# EAGLE schematic Table (EAGLE 6.5.0)
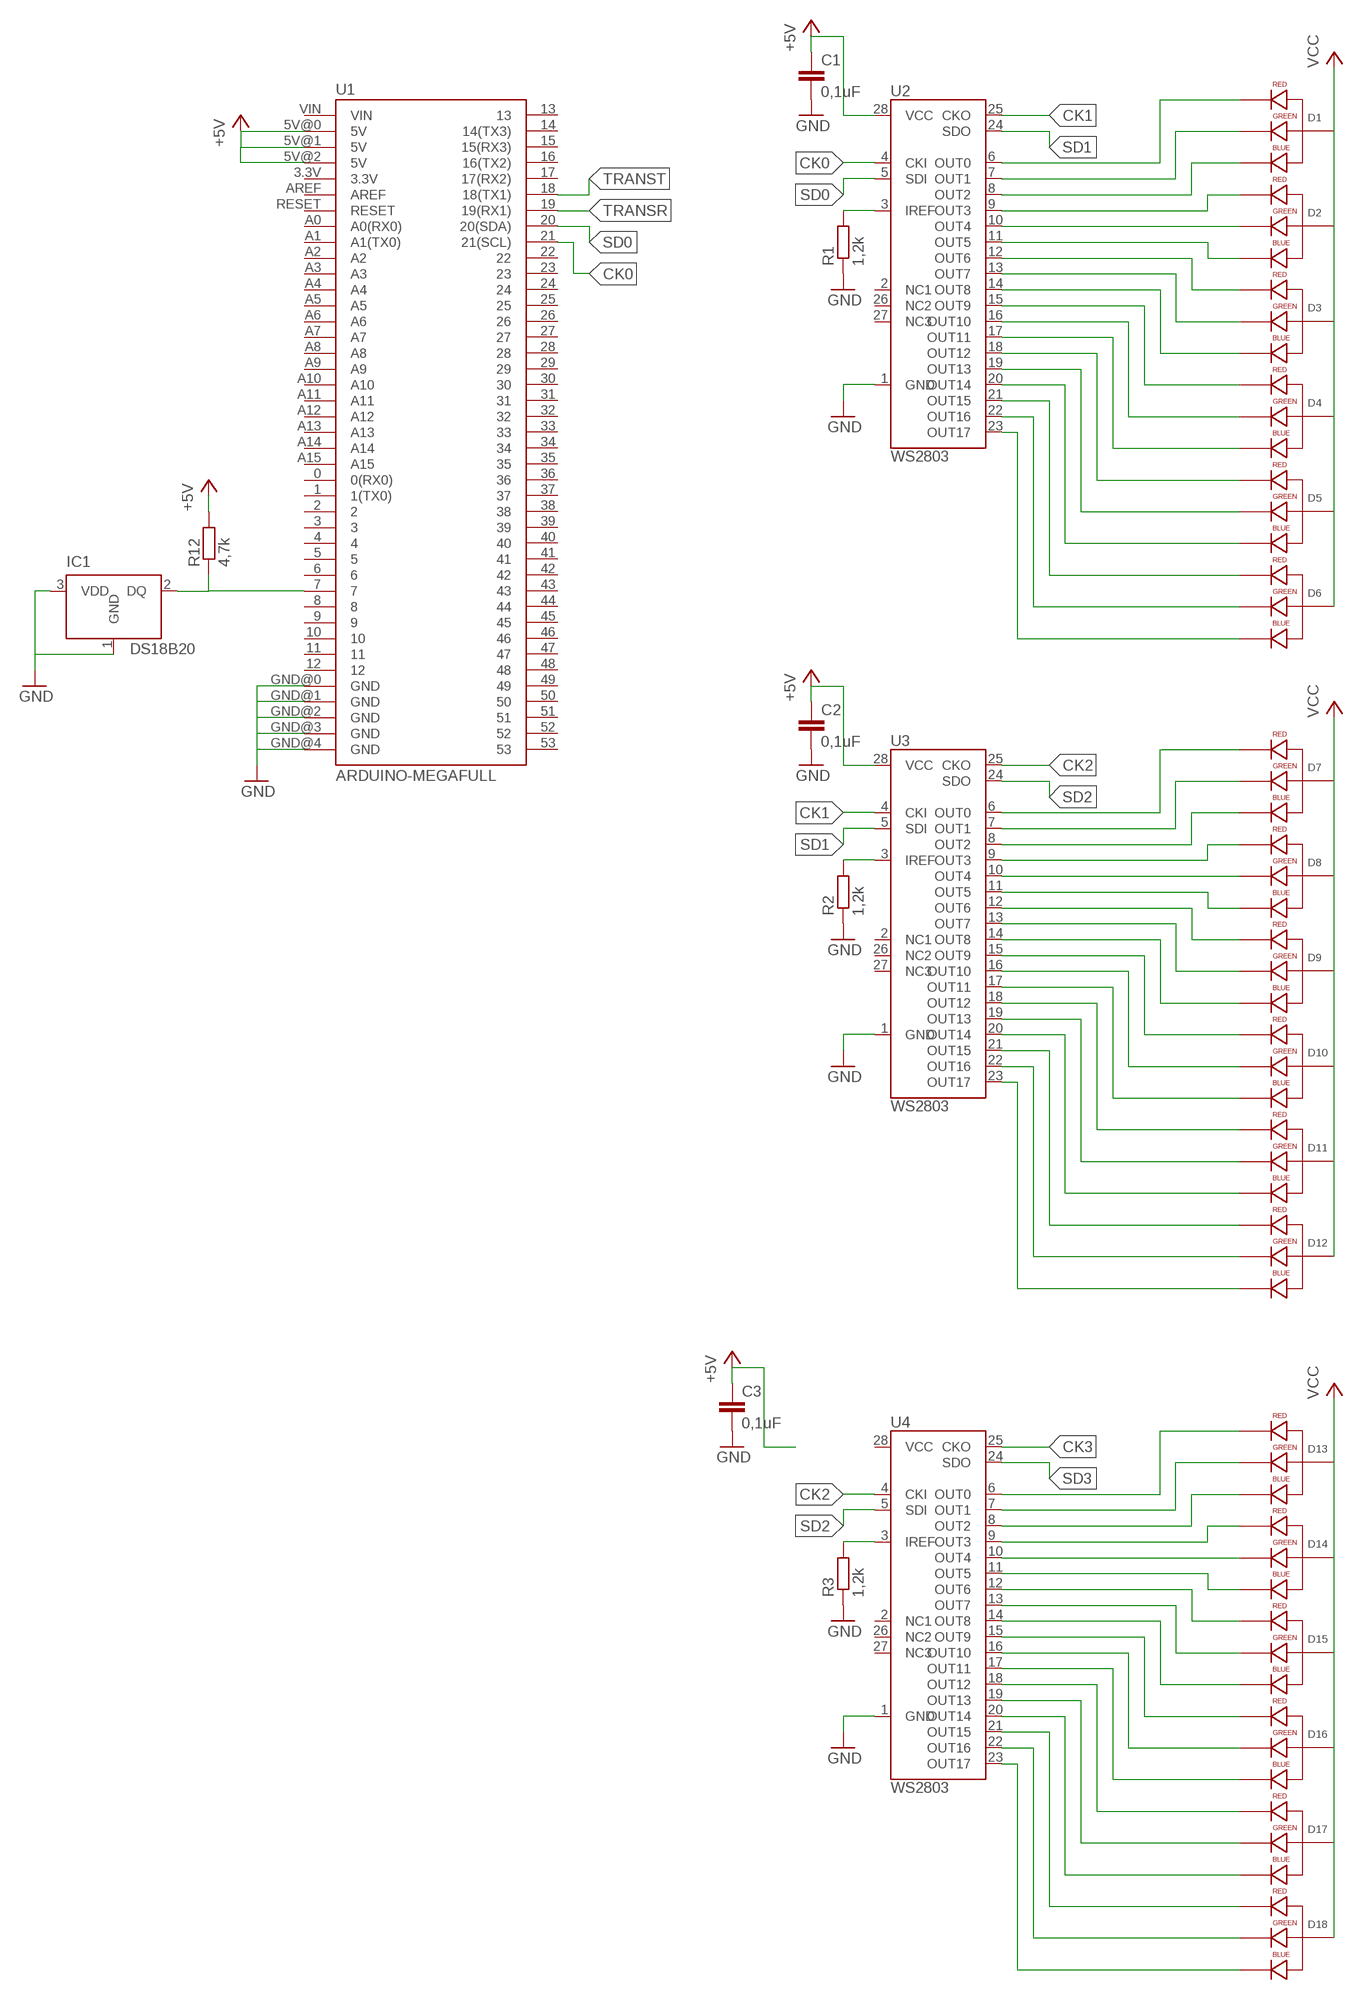
[diagram p0: schematic, sheet 1, part 1 of 2]
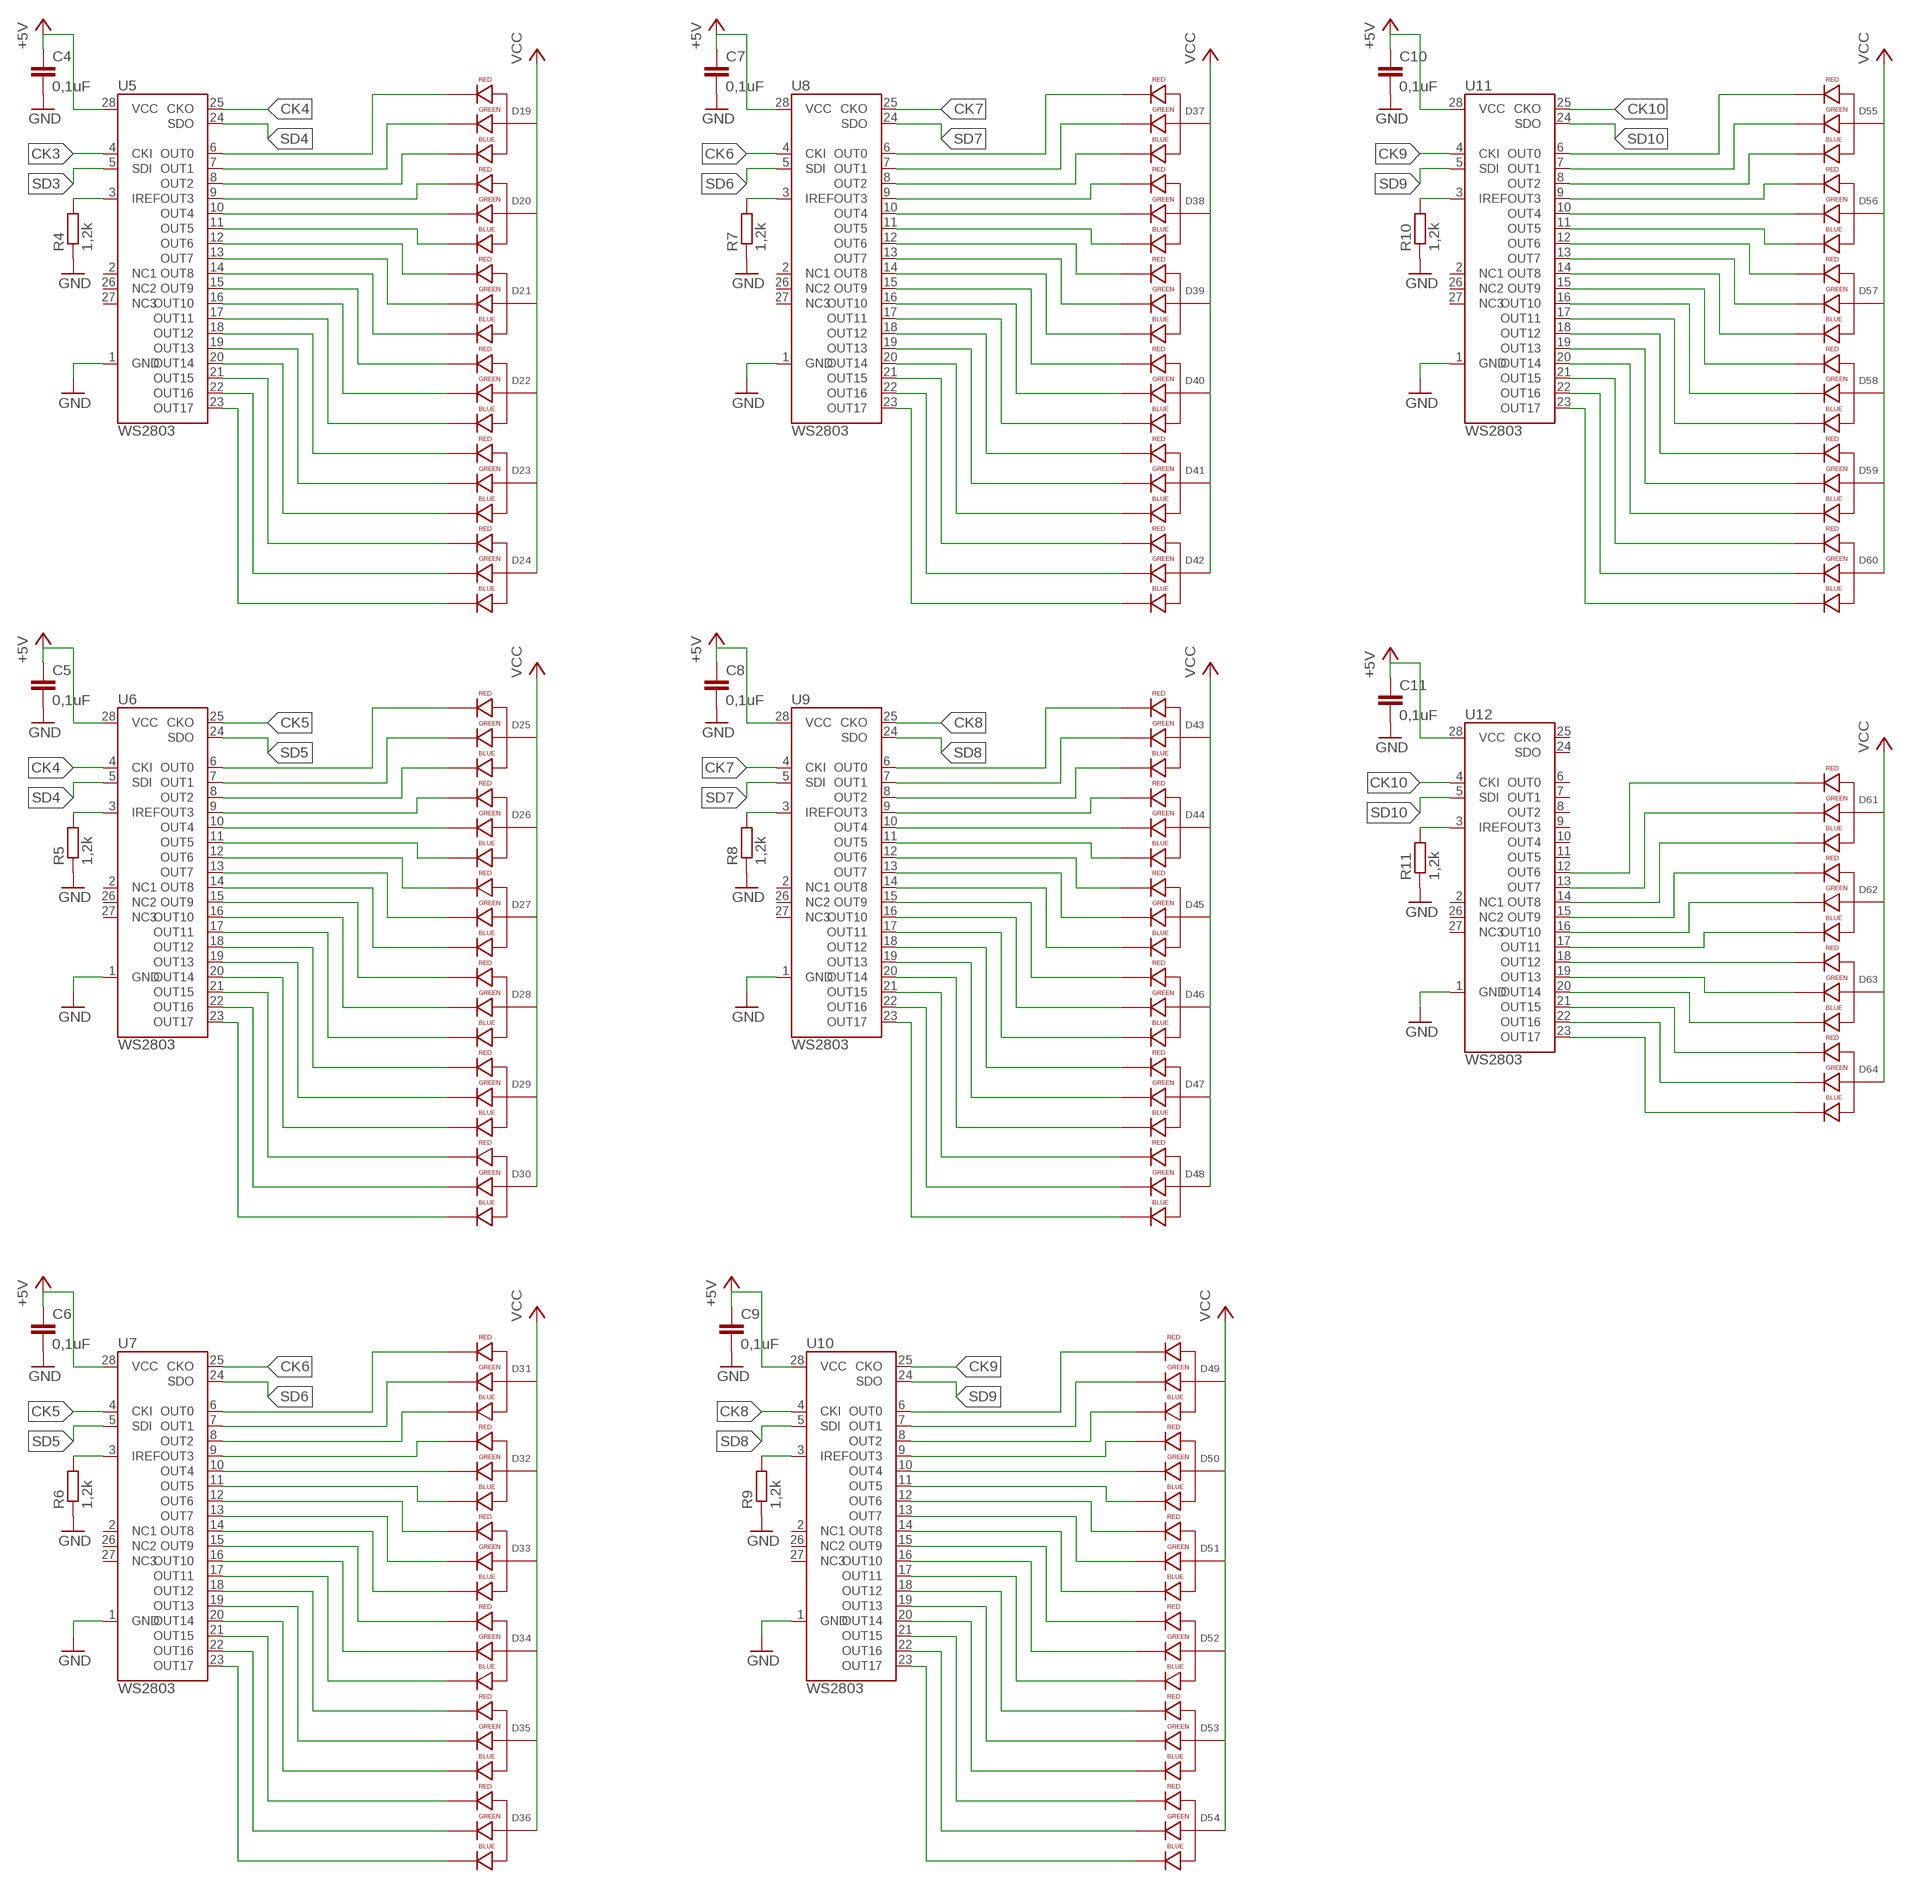
[diagram p1: schematic, sheet 1, part 2 of 2]

## Parts
C1  0,1uF  CAPPTH  [CAP-PTH-SMALL]
C2  0,1uF  CAPPTH  [CAP-PTH-SMALL]
C3  0,1uF  CAPPTH  [CAP-PTH-SMALL]
C4  0,1uF  CAPPTH  [CAP-PTH-SMALL]
C5  0,1uF  CAPPTH  [CAP-PTH-SMALL]
C6  0,1uF  CAPPTH  [CAP-PTH-SMALL]
C7  0,1uF  CAPPTH  [CAP-PTH-SMALL]
C8  0,1uF  CAPPTH  [CAP-PTH-SMALL]
C9  0,1uF  CAPPTH  [CAP-PTH-SMALL]
C10  0,1uF  CAPPTH  [CAP-PTH-SMALL]
C11  0,1uF  CAPPTH  [CAP-PTH-SMALL]
D1  LED-RGB-CA-THRUDIFFUSE  [LED-RGB-THRU]
D2  LED-RGB-CA-THRUDIFFUSE  [LED-RGB-THRU]
D3  LED-RGB-CA-THRUDIFFUSE  [LED-RGB-THRU]
D4  LED-RGB-CA-THRUDIFFUSE  [LED-RGB-THRU]
D5  LED-RGB-CA-THRUDIFFUSE  [LED-RGB-THRU]
D6  LED-RGB-CA-THRUDIFFUSE  [LED-RGB-THRU]
D7  LED-RGB-CA-THRUDIFFUSE  [LED-RGB-THRU]
D8  LED-RGB-CA-THRUDIFFUSE  [LED-RGB-THRU]
D9  LED-RGB-CA-THRUDIFFUSE  [LED-RGB-THRU]
D10  LED-RGB-CA-THRUDIFFUSE  [LED-RGB-THRU]
D11  LED-RGB-CA-THRUDIFFUSE  [LED-RGB-THRU]
D12  LED-RGB-CA-THRUDIFFUSE  [LED-RGB-THRU]
D13  LED-RGB-CA-THRUDIFFUSE  [LED-RGB-THRU]
D14  LED-RGB-CA-THRUDIFFUSE  [LED-RGB-THRU]
D15  LED-RGB-CA-THRUDIFFUSE  [LED-RGB-THRU]
D16  LED-RGB-CA-THRUDIFFUSE  [LED-RGB-THRU]
D17  LED-RGB-CA-THRUDIFFUSE  [LED-RGB-THRU]
D18  LED-RGB-CA-THRUDIFFUSE  [LED-RGB-THRU]
D19  LED-RGB-CA-THRUDIFFUSE  [LED-RGB-THRU]
D20  LED-RGB-CA-THRUDIFFUSE  [LED-RGB-THRU]
D21  LED-RGB-CA-THRUDIFFUSE  [LED-RGB-THRU]
D22  LED-RGB-CA-THRUDIFFUSE  [LED-RGB-THRU]
D23  LED-RGB-CA-THRUDIFFUSE  [LED-RGB-THRU]
D24  LED-RGB-CA-THRUDIFFUSE  [LED-RGB-THRU]
D25  LED-RGB-CA-THRUDIFFUSE  [LED-RGB-THRU]
D26  LED-RGB-CA-THRUDIFFUSE  [LED-RGB-THRU]
D27  LED-RGB-CA-THRUDIFFUSE  [LED-RGB-THRU]
D28  LED-RGB-CA-THRUDIFFUSE  [LED-RGB-THRU]
D29  LED-RGB-CA-THRUDIFFUSE  [LED-RGB-THRU]
D30  LED-RGB-CA-THRUDIFFUSE  [LED-RGB-THRU]
D31  LED-RGB-CA-THRUDIFFUSE  [LED-RGB-THRU]
D32  LED-RGB-CA-THRUDIFFUSE  [LED-RGB-THRU]
D33  LED-RGB-CA-THRUDIFFUSE  [LED-RGB-THRU]
D34  LED-RGB-CA-THRUDIFFUSE  [LED-RGB-THRU]
D35  LED-RGB-CA-THRUDIFFUSE  [LED-RGB-THRU]
D36  LED-RGB-CA-THRUDIFFUSE  [LED-RGB-THRU]
D37  LED-RGB-CA-THRUDIFFUSE  [LED-RGB-THRU]
D38  LED-RGB-CA-THRUDIFFUSE  [LED-RGB-THRU]
D39  LED-RGB-CA-THRUDIFFUSE  [LED-RGB-THRU]
D40  LED-RGB-CA-THRUDIFFUSE  [LED-RGB-THRU]
D41  LED-RGB-CA-THRUDIFFUSE  [LED-RGB-THRU]
D42  LED-RGB-CA-THRUDIFFUSE  [LED-RGB-THRU]
D43  LED-RGB-CA-THRUDIFFUSE  [LED-RGB-THRU]
D44  LED-RGB-CA-THRUDIFFUSE  [LED-RGB-THRU]
D45  LED-RGB-CA-THRUDIFFUSE  [LED-RGB-THRU]
D46  LED-RGB-CA-THRUDIFFUSE  [LED-RGB-THRU]
D47  LED-RGB-CA-THRUDIFFUSE  [LED-RGB-THRU]
D48  LED-RGB-CA-THRUDIFFUSE  [LED-RGB-THRU]
D49  LED-RGB-CA-THRUDIFFUSE  [LED-RGB-THRU]
D50  LED-RGB-CA-THRUDIFFUSE  [LED-RGB-THRU]
D51  LED-RGB-CA-THRUDIFFUSE  [LED-RGB-THRU]
D52  LED-RGB-CA-THRUDIFFUSE  [LED-RGB-THRU]
D53  LED-RGB-CA-THRUDIFFUSE  [LED-RGB-THRU]
D54  LED-RGB-CA-THRUDIFFUSE  [LED-RGB-THRU]
D55  LED-RGB-CA-THRUDIFFUSE  [LED-RGB-THRU]
D56  LED-RGB-CA-THRUDIFFUSE  [LED-RGB-THRU]
D57  LED-RGB-CA-THRUDIFFUSE  [LED-RGB-THRU]
D58  LED-RGB-CA-THRUDIFFUSE  [LED-RGB-THRU]
D59  LED-RGB-CA-THRUDIFFUSE  [LED-RGB-THRU]
D60  LED-RGB-CA-THRUDIFFUSE  [LED-RGB-THRU]
D61  LED-RGB-CA-THRUDIFFUSE  [LED-RGB-THRU]
D62  LED-RGB-CA-THRUDIFFUSE  [LED-RGB-THRU]
D63  LED-RGB-CA-THRUDIFFUSE  [LED-RGB-THRU]
D64  LED-RGB-CA-THRUDIFFUSE  [LED-RGB-THRU]
IC1  DS18B20  DS1820  [TO-92]
R1  1,2k  R-EU_0204/5  [0204/5]
R2  1,2k  R-EU_0204/5  [0204/5]
R3  1,2k  R-EU_0204/5  [0204/5]
R4  1,2k  R-EU_0204/5  [0204/5]
R5  1,2k  R-EU_0204/5  [0204/5]
R6  1,2k  R-EU_0204/5  [0204/5]
R7  1,2k  R-EU_0204/5  [0204/5]
R8  1,2k  R-EU_0204/5  [0204/5]
R9  1,2k  R-EU_0204/5  [0204/5]
R10  1,2k  R-EU_0204/5  [0204/5]
R11  1,2k  R-EU_0204/5  [0204/5]
R12  4,7k  R-EU_0204/5  [0204/5]
U1  ARDUINO-MEGAFULL  [ARDUINO_MEGA]
U2  WS2803  [SOP-28]
U3  WS2803  [SOP-28]
U4  WS2803  [SOP-28]
U5  WS2803  [SOP-28]
U6  WS2803  [SOP-28]
U7  WS2803  [SOP-28]
U8  WS2803  [SOP-28]
U9  WS2803  [SOP-28]
U10  WS2803  [SOP-28]
U11  WS2803  [SOP-28]
U12  WS2803  [SOP-28]

## Nets
+5V: C1.1 C2.1 C3.1 C4.1 C5.1 C6.1 C7.1 C8.1 C9.1 C10.1 C11.1 R12.2 U1.5V@0(5V) U1.5V@1(5V) U1.5V@2(5V) U2.28(VCC)
CK0: U1.21(21(SCL)) U2.4(CKI)
CK1: U2.25(CKO) U3.4(CKI)
CK2: U3.25(CKO) U4.4(CKI)
CK3: U4.25(CKO) U5.4(CKI)
CK4: U5.25(CKO) U6.4(CKI)
CK5: U6.25(CKO) U7.4(CKI)
CK6: U7.25(CKO) U8.4(CKI)
CK7: U8.25(CKO) U9.4(CKI)
CK8: U9.25(CKO) U10.4(CKI)
CK9: U10.25(CKO) U11.4(CKI)
CK10: U11.25(CKO) U12.4(CKI)
GND: C1.2 C2.2 C3.2 C4.2 C5.2 C6.2 C7.2 C8.2 C9.2 C10.2 C11.2 IC1.1(GND) IC1.3(VDD) R1.1 R2.1 R3.1 R4.1 R5.1 R6.1 R7.1 R8.1 R9.1 R10.1 R11.1 U1.GND@0(GND) U1.GND@1(GND) U1.GND@2(GND) U1.GND@3(GND) U1.GND@4(GND) U2.1(GND) U3.1(GND) U4.1(GND) U5.1(GND) U6.1(GND) U7.1(GND) U8.1(GND) U9.1(GND) U10.1(GND) U11.1(GND) U12.1(GND)
N$1: R1.2 U2.3(IREF)
N$2: D1.1(RED_CATHODE) U2.6(OUT0)
N$3: D1.3(GREEN_CATHODE) U2.7(OUT1)
N$4: D1.4(BLUE_CATHODE) U2.8(OUT2)
N$5: D2.1(RED_CATHODE) U2.9(OUT3)
N$6: D2.3(GREEN_CATHODE) U2.10(OUT4)
N$7: D2.4(BLUE_CATHODE) U2.11(OUT5)
N$8: D3.1(RED_CATHODE) U2.12(OUT6)
N$9: D3.3(GREEN_CATHODE) U2.13(OUT7)
N$10: D3.4(BLUE_CATHODE) U2.14(OUT8)
N$11: D4.1(RED_CATHODE) U2.15(OUT9)
N$12: D4.3(GREEN_CATHODE) U2.16(OUT10)
N$13: D4.4(BLUE_CATHODE) U2.17(OUT11)
N$14: D5.1(RED_CATHODE) U2.18(OUT12)
N$15: D5.3(GREEN_CATHODE) U2.19(OUT13)
N$16: D5.4(BLUE_CATHODE) U2.20(OUT14)
N$17: D6.1(RED_CATHODE) U2.21(OUT15)
N$18: D6.3(GREEN_CATHODE) U2.22(OUT16)
N$19: D6.4(BLUE_CATHODE) U2.23(OUT17)
N$20: R2.2 U3.3(IREF)
N$21: D7.1(RED_CATHODE) U3.6(OUT0)
N$22: D7.3(GREEN_CATHODE) U3.7(OUT1)
N$23: D7.4(BLUE_CATHODE) U3.8(OUT2)
N$24: D8.1(RED_CATHODE) U3.9(OUT3)
N$25: D8.3(GREEN_CATHODE) U3.10(OUT4)
N$26: D8.4(BLUE_CATHODE) U3.11(OUT5)
N$27: D9.1(RED_CATHODE) U3.12(OUT6)
N$28: D9.3(GREEN_CATHODE) U3.13(OUT7)
N$29: D9.4(BLUE_CATHODE) U3.14(OUT8)
N$30: D10.1(RED_CATHODE) U3.15(OUT9)
N$31: D10.3(GREEN_CATHODE) U3.16(OUT10)
N$32: D10.4(BLUE_CATHODE) U3.17(OUT11)
N$33: D11.1(RED_CATHODE) U3.18(OUT12)
N$34: D11.3(GREEN_CATHODE) U3.19(OUT13)
N$35: D11.4(BLUE_CATHODE) U3.20(OUT14)
N$36: D12.1(RED_CATHODE) U3.21(OUT15)
N$37: D12.3(GREEN_CATHODE) U3.22(OUT16)
N$38: D12.4(BLUE_CATHODE) U3.23(OUT17)
N$39: R3.2 U4.3(IREF)
N$40: D13.1(RED_CATHODE) U4.6(OUT0)
N$41: D13.3(GREEN_CATHODE) U4.7(OUT1)
N$42: D13.4(BLUE_CATHODE) U4.8(OUT2)
N$43: D14.1(RED_CATHODE) U4.9(OUT3)
N$44: D14.3(GREEN_CATHODE) U4.10(OUT4)
N$45: D14.4(BLUE_CATHODE) U4.11(OUT5)
N$46: D15.1(RED_CATHODE) U4.12(OUT6)
N$47: D15.3(GREEN_CATHODE) U4.13(OUT7)
N$48: D15.4(BLUE_CATHODE) U4.14(OUT8)
N$49: D16.1(RED_CATHODE) U4.15(OUT9)
N$50: D16.3(GREEN_CATHODE) U4.16(OUT10)
N$51: D16.4(BLUE_CATHODE) U4.17(OUT11)
N$52: D17.1(RED_CATHODE) U4.18(OUT12)
N$53: D17.3(GREEN_CATHODE) U4.19(OUT13)
N$54: D17.4(BLUE_CATHODE) U4.20(OUT14)
N$55: D18.1(RED_CATHODE) U4.21(OUT15)
N$56: D18.3(GREEN_CATHODE) U4.22(OUT16)
N$57: D18.4(BLUE_CATHODE) U4.23(OUT17)
N$58: R4.2 U5.3(IREF)
N$59: D19.1(RED_CATHODE) U5.6(OUT0)
N$60: D19.3(GREEN_CATHODE) U5.7(OUT1)
N$61: D19.4(BLUE_CATHODE) U5.8(OUT2)
N$62: D20.1(RED_CATHODE) U5.9(OUT3)
N$63: D20.3(GREEN_CATHODE) U5.10(OUT4)
N$64: D20.4(BLUE_CATHODE) U5.11(OUT5)
N$65: D21.1(RED_CATHODE) U5.12(OUT6)
N$66: D21.3(GREEN_CATHODE) U5.13(OUT7)
N$67: D21.4(BLUE_CATHODE) U5.14(OUT8)
N$68: D22.1(RED_CATHODE) U5.15(OUT9)
N$69: D22.3(GREEN_CATHODE) U5.16(OUT10)
N$70: D22.4(BLUE_CATHODE) U5.17(OUT11)
N$71: D23.1(RED_CATHODE) U5.18(OUT12)
N$72: D23.3(GREEN_CATHODE) U5.19(OUT13)
N$73: D23.4(BLUE_CATHODE) U5.20(OUT14)
N$74: D24.1(RED_CATHODE) U5.21(OUT15)
N$75: D24.3(GREEN_CATHODE) U5.22(OUT16)
N$76: D24.4(BLUE_CATHODE) U5.23(OUT17)
N$77: R5.2 U6.3(IREF)
N$78: D25.1(RED_CATHODE) U6.6(OUT0)
N$79: D25.3(GREEN_CATHODE) U6.7(OUT1)
N$80: D25.4(BLUE_CATHODE) U6.8(OUT2)
N$81: D26.1(RED_CATHODE) U6.9(OUT3)
N$82: D26.3(GREEN_CATHODE) U6.10(OUT4)
N$83: D26.4(BLUE_CATHODE) U6.11(OUT5)
N$84: D27.1(RED_CATHODE) U6.12(OUT6)
N$85: D27.3(GREEN_CATHODE) U6.13(OUT7)
N$86: D27.4(BLUE_CATHODE) U6.14(OUT8)
N$87: D28.1(RED_CATHODE) U6.15(OUT9)
N$88: D28.3(GREEN_CATHODE) U6.16(OUT10)
N$89: D28.4(BLUE_CATHODE) U6.17(OUT11)
N$90: D29.1(RED_CATHODE) U6.18(OUT12)
N$91: D29.3(GREEN_CATHODE) U6.19(OUT13)
N$92: D29.4(BLUE_CATHODE) U6.20(OUT14)
N$93: D30.1(RED_CATHODE) U6.21(OUT15)
N$94: D30.3(GREEN_CATHODE) U6.22(OUT16)
N$95: D30.4(BLUE_CATHODE) U6.23(OUT17)
N$96: R6.2 U7.3(IREF)
N$97: D31.1(RED_CATHODE) U7.6(OUT0)
N$98: D31.3(GREEN_CATHODE) U7.7(OUT1)
N$99: D31.4(BLUE_CATHODE) U7.8(OUT2)
N$100: D32.1(RED_CATHODE) U7.9(OUT3)
N$101: D32.3(GREEN_CATHODE) U7.10(OUT4)
N$102: D32.4(BLUE_CATHODE) U7.11(OUT5)
N$103: D33.1(RED_CATHODE) U7.12(OUT6)
N$104: D33.3(GREEN_CATHODE) U7.13(OUT7)
N$105: D33.4(BLUE_CATHODE) U7.14(OUT8)
N$106: D34.1(RED_CATHODE) U7.15(OUT9)
N$107: D34.3(GREEN_CATHODE) U7.16(OUT10)
N$108: D34.4(BLUE_CATHODE) U7.17(OUT11)
N$109: D35.1(RED_CATHODE) U7.18(OUT12)
N$110: D35.3(GREEN_CATHODE) U7.19(OUT13)
N$111: D35.4(BLUE_CATHODE) U7.20(OUT14)
N$112: D36.1(RED_CATHODE) U7.21(OUT15)
N$113: D36.3(GREEN_CATHODE) U7.22(OUT16)
N$114: D36.4(BLUE_CATHODE) U7.23(OUT17)
N$115: R7.2 U8.3(IREF)
N$116: D37.1(RED_CATHODE) U8.6(OUT0)
N$117: D37.3(GREEN_CATHODE) U8.7(OUT1)
N$118: D37.4(BLUE_CATHODE) U8.8(OUT2)
N$119: D38.1(RED_CATHODE) U8.9(OUT3)
N$120: D38.3(GREEN_CATHODE) U8.10(OUT4)
N$121: D38.4(BLUE_CATHODE) U8.11(OUT5)
N$122: D39.1(RED_CATHODE) U8.12(OUT6)
N$123: D39.3(GREEN_CATHODE) U8.13(OUT7)
N$124: D39.4(BLUE_CATHODE) U8.14(OUT8)
N$125: D40.1(RED_CATHODE) U8.15(OUT9)
N$126: D40.3(GREEN_CATHODE) U8.16(OUT10)
N$127: D40.4(BLUE_CATHODE) U8.17(OUT11)
N$128: D41.1(RED_CATHODE) U8.18(OUT12)
N$129: D41.3(GREEN_CATHODE) U8.19(OUT13)
N$130: D41.4(BLUE_CATHODE) U8.20(OUT14)
N$131: D42.1(RED_CATHODE) U8.21(OUT15)
N$132: D42.3(GREEN_CATHODE) U8.22(OUT16)
N$133: D42.4(BLUE_CATHODE) U8.23(OUT17)
N$134: R8.2 U9.3(IREF)
N$135: D43.1(RED_CATHODE) U9.6(OUT0)
N$136: D43.3(GREEN_CATHODE) U9.7(OUT1)
N$137: D43.4(BLUE_CATHODE) U9.8(OUT2)
N$138: D44.1(RED_CATHODE) U9.9(OUT3)
N$139: D44.3(GREEN_CATHODE) U9.10(OUT4)
N$140: D44.4(BLUE_CATHODE) U9.11(OUT5)
N$141: D45.1(RED_CATHODE) U9.12(OUT6)
N$142: D45.3(GREEN_CATHODE) U9.13(OUT7)
N$143: D45.4(BLUE_CATHODE) U9.14(OUT8)
N$144: D46.1(RED_CATHODE) U9.15(OUT9)
N$145: D46.3(GREEN_CATHODE) U9.16(OUT10)
N$146: D46.4(BLUE_CATHODE) U9.17(OUT11)
N$147: D47.1(RED_CATHODE) U9.18(OUT12)
N$148: D47.3(GREEN_CATHODE) U9.19(OUT13)
N$149: D47.4(BLUE_CATHODE) U9.20(OUT14)
N$150: D48.1(RED_CATHODE) U9.21(OUT15)
N$151: D48.3(GREEN_CATHODE) U9.22(OUT16)
N$152: D48.4(BLUE_CATHODE) U9.23(OUT17)
N$153: R9.2 U10.3(IREF)
N$154: D49.1(RED_CATHODE) U10.6(OUT0)
N$155: D49.3(GREEN_CATHODE) U10.7(OUT1)
N$156: D49.4(BLUE_CATHODE) U10.8(OUT2)
N$157: D50.1(RED_CATHODE) U10.9(OUT3)
N$158: D50.3(GREEN_CATHODE) U10.10(OUT4)
N$159: D50.4(BLUE_CATHODE) U10.11(OUT5)
N$160: D51.1(RED_CATHODE) U10.12(OUT6)
N$161: D51.3(GREEN_CATHODE) U10.13(OUT7)
N$162: D51.4(BLUE_CATHODE) U10.14(OUT8)
N$163: D52.1(RED_CATHODE) U10.15(OUT9)
N$164: D52.3(GREEN_CATHODE) U10.16(OUT10)
N$165: D52.4(BLUE_CATHODE) U10.17(OUT11)
N$166: D53.1(RED_CATHODE) U10.18(OUT12)
N$167: D53.3(GREEN_CATHODE) U10.19(OUT13)
N$168: D53.4(BLUE_CATHODE) U10.20(OUT14)
N$169: D54.1(RED_CATHODE) U10.21(OUT15)
N$170: D54.3(GREEN_CATHODE) U10.22(OUT16)
N$171: D54.4(BLUE_CATHODE) U10.23(OUT17)
N$172: R10.2 U11.3(IREF)
N$173: D55.1(RED_CATHODE) U11.6(OUT0)
N$174: D55.3(GREEN_CATHODE) U11.7(OUT1)
N$175: D55.4(BLUE_CATHODE) U11.8(OUT2)
N$176: D56.1(RED_CATHODE) U11.9(OUT3)
N$177: D56.3(GREEN_CATHODE) U11.10(OUT4)
N$178: D56.4(BLUE_CATHODE) U11.11(OUT5)
N$179: D57.1(RED_CATHODE) U11.12(OUT6)
N$180: D57.3(GREEN_CATHODE) U11.13(OUT7)
N$181: D57.4(BLUE_CATHODE) U11.14(OUT8)
N$182: D58.1(RED_CATHODE) U11.15(OUT9)
N$183: D58.3(GREEN_CATHODE) U11.16(OUT10)
N$184: D58.4(BLUE_CATHODE) U11.17(OUT11)
N$185: D59.1(RED_CATHODE) U11.18(OUT12)
N$186: D59.3(GREEN_CATHODE) U11.19(OUT13)
N$187: D59.4(BLUE_CATHODE) U11.20(OUT14)
N$188: D60.1(RED_CATHODE) U11.21(OUT15)
N$189: D60.3(GREEN_CATHODE) U11.22(OUT16)
N$190: D60.4(BLUE_CATHODE) U11.23(OUT17)
N$191: R11.2 U12.3(IREF)
N$192: D63.3(GREEN_CATHODE) U12.19(OUT13)
N$193: D64.1(RED_CATHODE) U12.21(OUT15)
N$194: D64.4(BLUE_CATHODE) U12.23(OUT17)
N$195: D64.3(GREEN_CATHODE) U12.22(OUT16)
N$196: D63.4(BLUE_CATHODE) U12.20(OUT14)
N$197: D63.1(RED_CATHODE) U12.18(OUT12)
N$198: D62.1(RED_CATHODE) U12.15(OUT9)
N$199: D61.4(BLUE_CATHODE) U12.14(OUT8)
N$200: D61.3(GREEN_CATHODE) U12.13(OUT7)
N$201: D61.1(RED_CATHODE) U12.12(OUT6)
N$202: D62.3(GREEN_CATHODE) U12.16(OUT10)
N$203: D62.4(BLUE_CATHODE) U12.17(OUT11)
N$205: IC1.2(DQ) R12.1 U1.7
SD0: U1.20(20(SDA)) U2.5(SDI)
SD1: U2.24(SDO) U3.5(SDI)
SD2: U3.24(SDO) U4.5(SDI)
SD3: U4.24(SDO) U5.5(SDI)
SD4: U5.24(SDO) U6.5(SDI)
SD5: U6.24(SDO) U7.5(SDI)
SD6: U7.24(SDO) U8.5(SDI)
SD7: U8.24(SDO) U9.5(SDI)
SD8: U9.24(SDO) U10.5(SDI)
SD9: U10.24(SDO) U11.5(SDI)
SD10: U11.24(SDO) U12.5(SDI)
TRANSR: U1.19(19(RX1))
TRANST: U1.18(18(TX1))
VCC: D1.2(ANODE) D2.2(ANODE) D3.2(ANODE) D4.2(ANODE) D5.2(ANODE) D6.2(ANODE) D7.2(ANODE) D8.2(ANODE) D9.2(ANODE) D10.2(ANODE) D11.2(ANODE) D12.2(ANODE) D13.2(ANODE) D14.2(ANODE) D15.2(ANODE) D16.2(ANODE) D17.2(ANODE) D18.2(ANODE) D19.2(ANODE) D20.2(ANODE) D21.2(ANODE) D22.2(ANODE) D23.2(ANODE) D24.2(ANODE) D25.2(ANODE) D26.2(ANODE) D27.2(ANODE) D28.2(ANODE) D29.2(ANODE) D30.2(ANODE) D31.2(ANODE) D32.2(ANODE) D33.2(ANODE) D34.2(ANODE) D35.2(ANODE) D36.2(ANODE) D37.2(ANODE) D38.2(ANODE) D39.2(ANODE) D40.2(ANODE) D41.2(ANODE) D42.2(ANODE) D43.2(ANODE) D44.2(ANODE) D45.2(ANODE) D46.2(ANODE) D47.2(ANODE) D48.2(ANODE) D49.2(ANODE) D50.2(ANODE) D51.2(ANODE) D52.2(ANODE) D53.2(ANODE) D54.2(ANODE) D55.2(ANODE) D56.2(ANODE) D57.2(ANODE) D58.2(ANODE) D59.2(ANODE) D60.2(ANODE) D61.2(ANODE) D62.2(ANODE) D63.2(ANODE) D64.2(ANODE)
Unconnected: U1.0(0(RX0)) U1.1(1(TX0)) U1.2 U1.3 U1.3.3V U1.4 U1.5 U1.6 U1.8 U1.9 U1.10 U1.11 U1.12 U1.13 U1.14(14(TX3)) U1.15(15(RX3)) U1.16(16(TX2)) U1.17(17(RX2)) U1.22 U1.23 U1.24 U1.25 U1.26 U1.27 U1.28 U1.29 U1.30 U1.31 U1.32 U1.33 U1.34 U1.35 U1.36 U1.37 U1.38 U1.39 U1.40 U1.41 U1.42 U1.43 U1.44 U1.45 U1.46 U1.47 U1.48 U1.49 U1.50 U1.51 U1.52 U1.53 U1.A0(A0(RX0)) U1.A1(A1(TX0)) U1.A2 U1.A3 U1.A4 U1.A5 U1.A6 U1.A7 U1.A8 U1.A9 U1.A10 U1.A11 U1.A12 U1.A13 U1.A14 U1.A15 U1.AREF U1.RESET U1.VIN U2.2(NC1) U2.26(NC2) U2.27(NC3) U3.2(NC1) U3.26(NC2) U3.27(NC3) U3.28(VCC) U4.2(NC1) U4.26(NC2) U4.27(NC3) U4.28(VCC) U5.2(NC1) U5.26(NC2) U5.27(NC3) U5.28(VCC) U6.2(NC1) U6.26(NC2) U6.27(NC3) U6.28(VCC) U7.2(NC1) U7.26(NC2) U7.27(NC3) U7.28(VCC) U8.2(NC1) U8.26(NC2) U8.27(NC3) U8.28(VCC) U9.2(NC1) U9.26(NC2) U9.27(NC3) U9.28(VCC) U10.2(NC1) U10.26(NC2) U10.27(NC3) U10.28(VCC) U11.2(NC1) U11.26(NC2) U11.27(NC3) U11.28(VCC) U12.2(NC1) U12.6(OUT0) U12.7(OUT1) U12.8(OUT2) U12.9(OUT3) U12.10(OUT4) U12.11(OUT5) U12.24(SDO) U12.25(CKO) U12.26(NC2) U12.27(NC3) U12.28(VCC)

## Library data of the parts
C1-C11 = SparkFun-Capacitors:CAP: Capacitor Standard 0603 ceramic capacitor, and 0.1" leaded capacitor.
D1-D64 = SparkFun-LED:LED-RGB-CA-THRU: RGB Through-hole common anode SparkFun store front COM-10821 (diffuse) COM-10820 (clear); PROD_ID: DIO-10632
IC1 = DS1820:DS1820: DS1820 - 1-Wire Digital Thermometer
R1-R12 = resistor:R-EU_: RESISTOR, European symbol
U1 = SparkFun-Boards:ARDUINO-MEGA: Arduino Mega board footprint
U2-U12 = WS2803:WS2803: WS2803 18 Channel Constant Current LED Driver with programmable PWM outputs.